# Altium schematic sheet [01] - MCU.SchDoc
size B
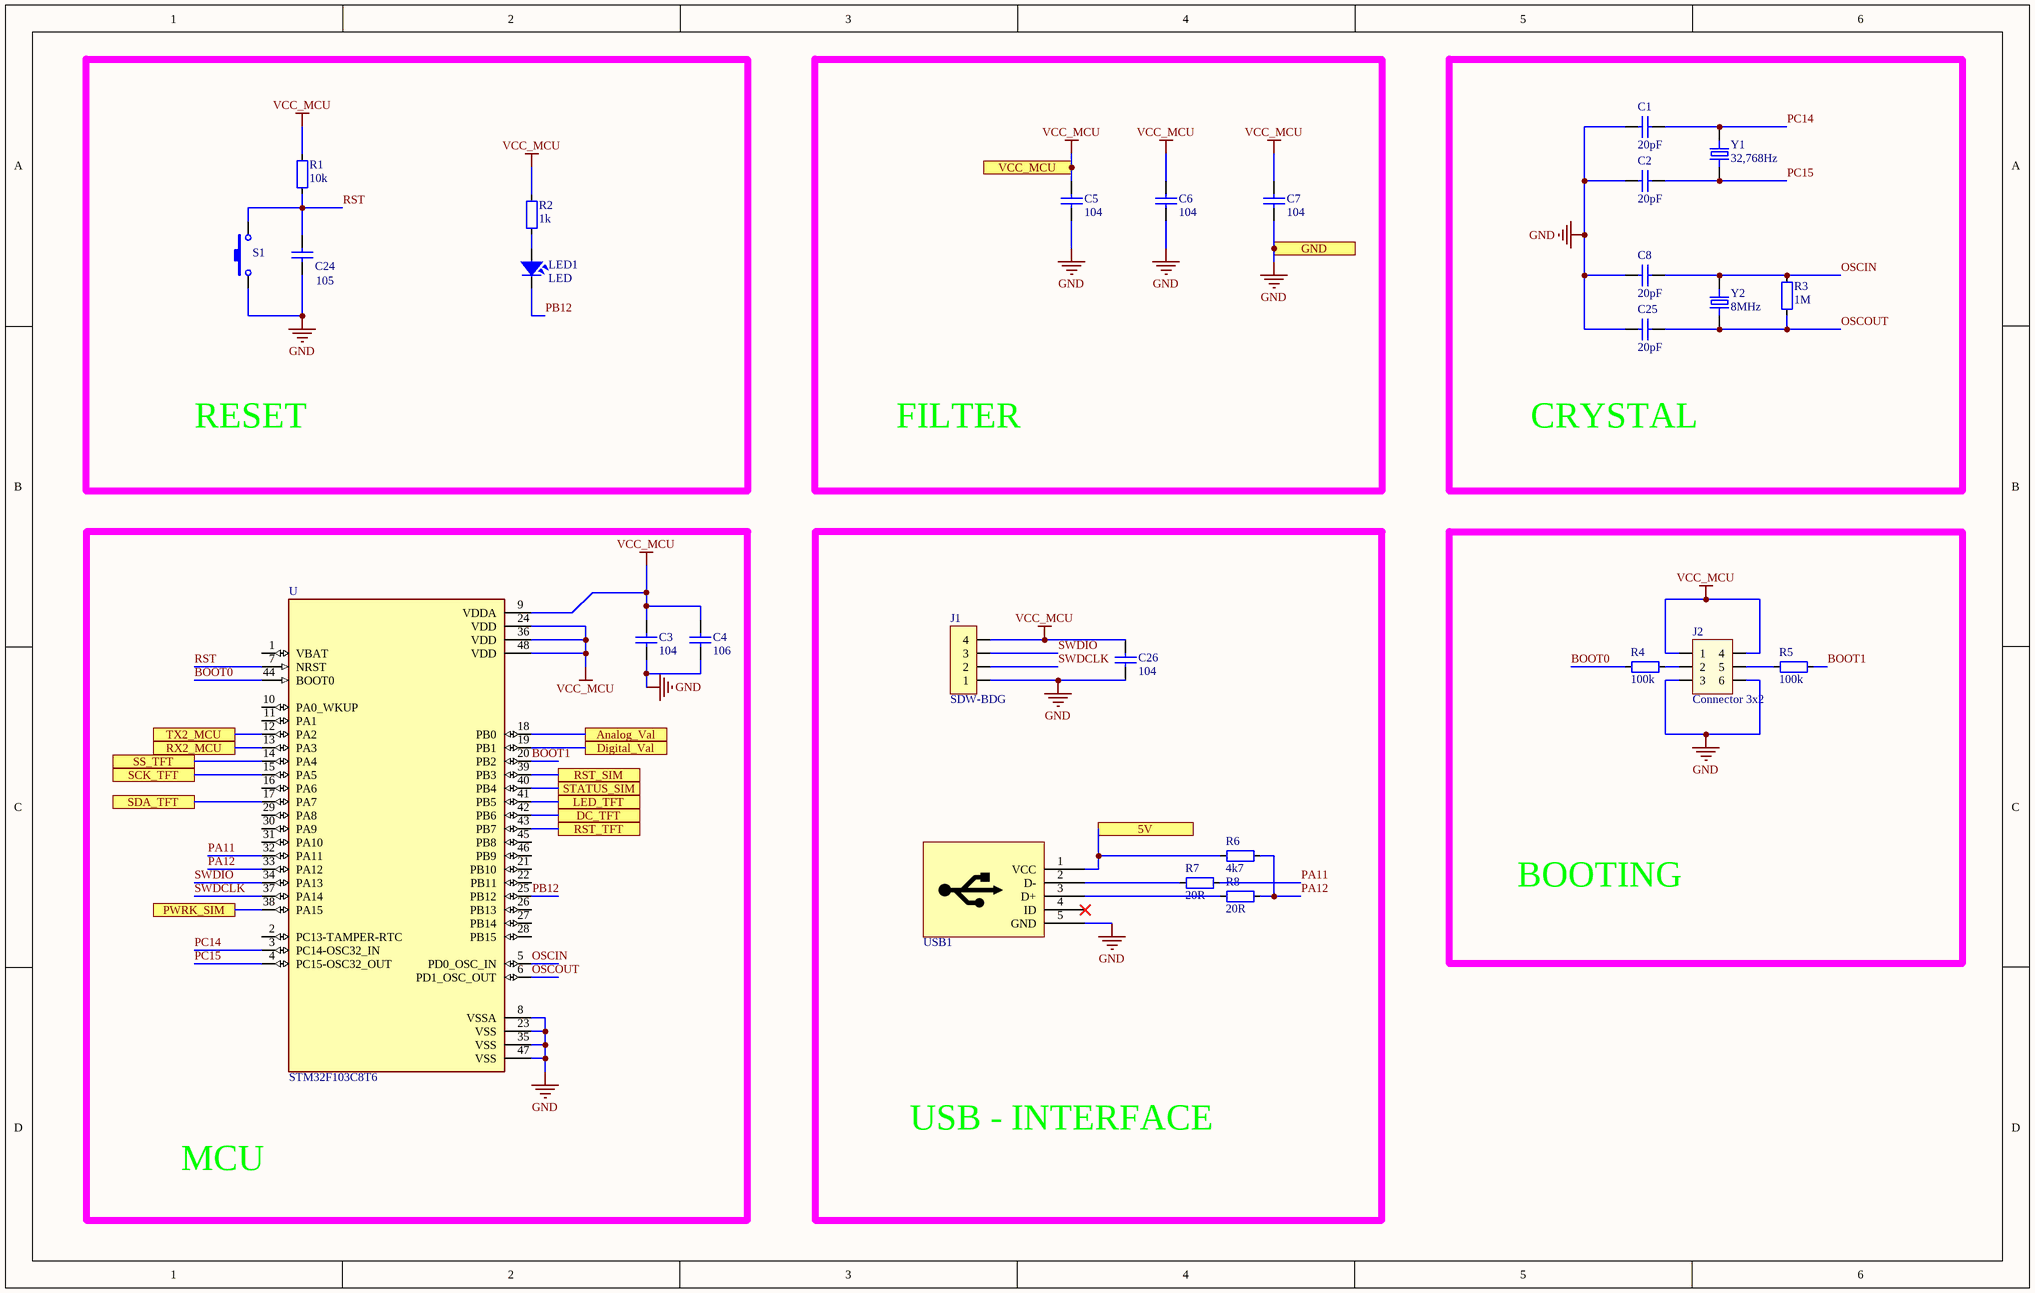
[diagram p0: [01] - MCU.SchDoc]

## Parts
C1  20pF  [CAP_0805]
C2  20pF  [CAP_0805]
C3  104  [CAP_0603]
C4  106  [CAP_1206]
C5  104  [CAP_0603]
C6  104  [CAP_0603]
C7  104  [CAP_0603]
C8  20pF  [CAP_0805]
C24  105  [CAP_0603]
C25  20pF  [CAP_0805]
C26  104  [CAP_0603]
J1  SDW-BDG  [JP4-D1C]
J2  Connector 3x2  [JP3x2]
LED1  LED  [LED-0805-Red]
R1  10k  [RES-SMD-0603]
R2  1k  [RES-SMD-0603]
R3  1M  [RES-SMD-0603]
R4  100k  [RES-SMD-0603]
R5  100k  [RES-SMD-0603]
R6  4k7  [RES-SMD-0603]
R7  20R  [RES-SMD-0603]
R8  20R  [RES-SMD-0603]
S1  SW-SMD  [SW 3x2x4]  (value not drawn)
U  STM32F103C8T6  [STM32F103C8T6]
USB1  USB  [USB-M1]  (value not drawn)
Y1  32,768Hz  [XTAL_ABLS-20.000MHZ-B4-T]
Y2  8MHz  [XTAL_ABLS-20.000MHZ-B4-T]

## Ports
5V, Analog_Val, DC_TFT, Digital_Val, GND, LED_TFT, PWRK_SIM, RST_SIM, RST_TFT, RX2_MCU, SCK_TFT, SDA_TFT, SS_TFT, STATUS_SIM, TX2_MCU, VCC_MCU

## Nets
GND: C1.1 C2.1 C3.1 C4.1 C5.1 C6.1 C7.1 C8.1 C24.1 C25.1 C26.1 J1.1 J2.3 J2.6 S1.1 U.8(VSSA) U.23(VSS) U.35(VSS) U.47(VSS) USB1.5(GND) ; port GND
VCC_MCU: C3.2 C4.2 C5.2 C6.2 C7.2 C26.2 J1.4 J2.1 J2.4 R1.2 R2.2 U.9(VDDA) U.24(VDD) U.36(VDD) U.48(VDD) ; port VCC_MCU
5V: R6.2 USB1.1(VCC) ; port 5V
Analog_Val: U.18(PB0) ; port Analog_Val
BOOT0: R4.1 U.44(BOOT0)
BOOT1: R5.2 U.20(PB2)
DC_TFT: U.42(PB6) ; port DC_TFT
Digital_Val: U.19(PB1) ; port Digital_Val
LED_TFT: U.41(PB5) ; port LED_TFT
OSCIN: C8.2 R3.2 U.5(PD0_OSC_IN) Y2.2
OSCOUT: C25.2 R3.1 U.6(PD1_OSC_OUT) Y2.1
PA11: R7.2 U.32(PA11)
PA12: R6.1 R8.2 U.33(PA12)
PB12: LED1.2 U.25(PB12)
PC14: C1.2 U.3(PC14-OSC32_IN) Y1.2
PC15: C2.2 U.4(PC15-OSC32_OUT) Y1.1
PWRK_SIM: U.38(PA15) ; port PWRK_SIM
RST: C24.2 R1.1 S1.2 U.7(NRST)
RST_SIM: U.39(PB3) ; port RST_SIM
RST_TFT: U.43(PB7) ; port RST_TFT
RX2_MCU: U.13(PA3) ; port RX2_MCU
SCK_TFT: U.15(PA5) ; port SCK_TFT
SDA_TFT: U.17(PA7) ; port SDA_TFT
SS_TFT: U.14(PA4) ; port SS_TFT
STATUS_SIM: U.40(PB4) ; port STATUS_SIM
SWDCLK: J1.2 U.37(PA14)
SWDIO: J1.3 U.34(PA13)
TX2_MCU: U.12(PA2) ; port TX2_MCU
NetJ2_2: J2.2 R4.2
NetJ2_5: J2.5 R5.1
NetLED1_1: LED1.1 R2.1
NetR7_1: R7.1 USB1.2(D-)
NetR8_1: R8.1 USB1.3(D+)

Not connected (* = marked no-connect by the designer): U 1(VBAT) 2(PC13-TAMPER-RTC) 10(PA0_WKUP) 11(PA1) 16(PA6) 21(PB10) 22(PB11) 26(PB13) 27(PB14) 28(PB15) 29(PA8) 30(PA9) 31(PA10) 45(PB8) 46(PB9); USB1 4(ID)*

## Notes on the sheet
- RESET
- FILTER
- CRYSTAL
- BOOTING
- MCU
- USB - INTERFACE
- Title
- Size:
- Date:
- Orcad B
- Number:
- Time:
- Revision:
- Sheet
- of
- File:

## Library data of the parts
C1-C8 C24-C26 = CapSMD: Capacitor; Value: 33p; Published: 8-Jun-2000; LatestRevisionDate: 17-Jul-2002; LatestRevisionNote: Re-released for DXP Platform.; PackageReference: RAD-0.3; Publisher: Altium Limited
J1 = JP4: WR-PHD 2.54 mm Angled Socket Header; Manufacturer: W¨¹rth Elektronik eiSos GmbH; partNo: 613004143121; ComponentLink1 Description: Manufacturer; ComponentLink2 Description: Datasheet; NoPins: 04; Created Date: 29 March 2013; ComponentLink1URL: http://www.we-online.com; ComponentLink2URL: http://katalog.we-online.de/em/datasheet/6130xx143121.pdf; Created by: Karrer Zheng
J2 = JP3x2: Value: Connector 3x2
LED1 = LED: LED Single colour Green and Red; Value: LED 3 ly Single Colour
R1-R8 = Resistor - SMD: Resistor; Manufacturer: Generic Components; Class: Passive; Published: 08/06/2000; Publisher: Altium Hobart Technology Centre
S1 = SW-SMD: Switch; Published: 24-Mar-1999; LatestRevisionDate: 17-Jul-2002; LatestRevisionNote: Re-released for DXP Platform.; PackageReference: SPST-2; Publisher: Altium Limited; ComponentLink1Description: https://shopee.vn/-Home-Living-100pcs-3X6X2.5mm-Tactile-Push-Button-Switch-Tact-Switch-Micro-Switch-SMD-i.329424082.5262213627; ComponentLink1URL: https://shopee.vn/-Home-Living-100pcs-3X6X2.5mm-Tactile-Push-Button-Switch-Tact-Switch-Micro-Switch-SMD-i.329424082.5262213627
U = STM32F103C8T6: ARMÂ® CortexÂ®-M3 STM32F1 Microcontroller IC 32-Bit 72MHz 64KB _64K x 8_ FLASH; MF: STMicroelectronics; Price: None; Package: LQFP-48 STMicroelectronics; Value: *; MP: STM32F103C8T6; Availability: Unavailable; SnapEDA_Link: https://www.snapeda.com/parts/STM32F103C8T6/STMicroelectronics/view-part/52195/?ref=snap
USB1 = USB-micro
Y1 Y2 = Crystal: 8MHz Â±20ppm Crystal 18pF 80 Ohms HC-49/US; MP: ABLS-8.000MHZ-B2; MF: Abracon LLC; Value: *; Package: HC-49/US Abracon LLC; SnapEDA_Link: https://www.snapeda.com/parts/ABLS-8.000MHZ-B2/Abracon%20LLC/view-part/2753215/?ref=snap; Price: None; Availability: Unavailable